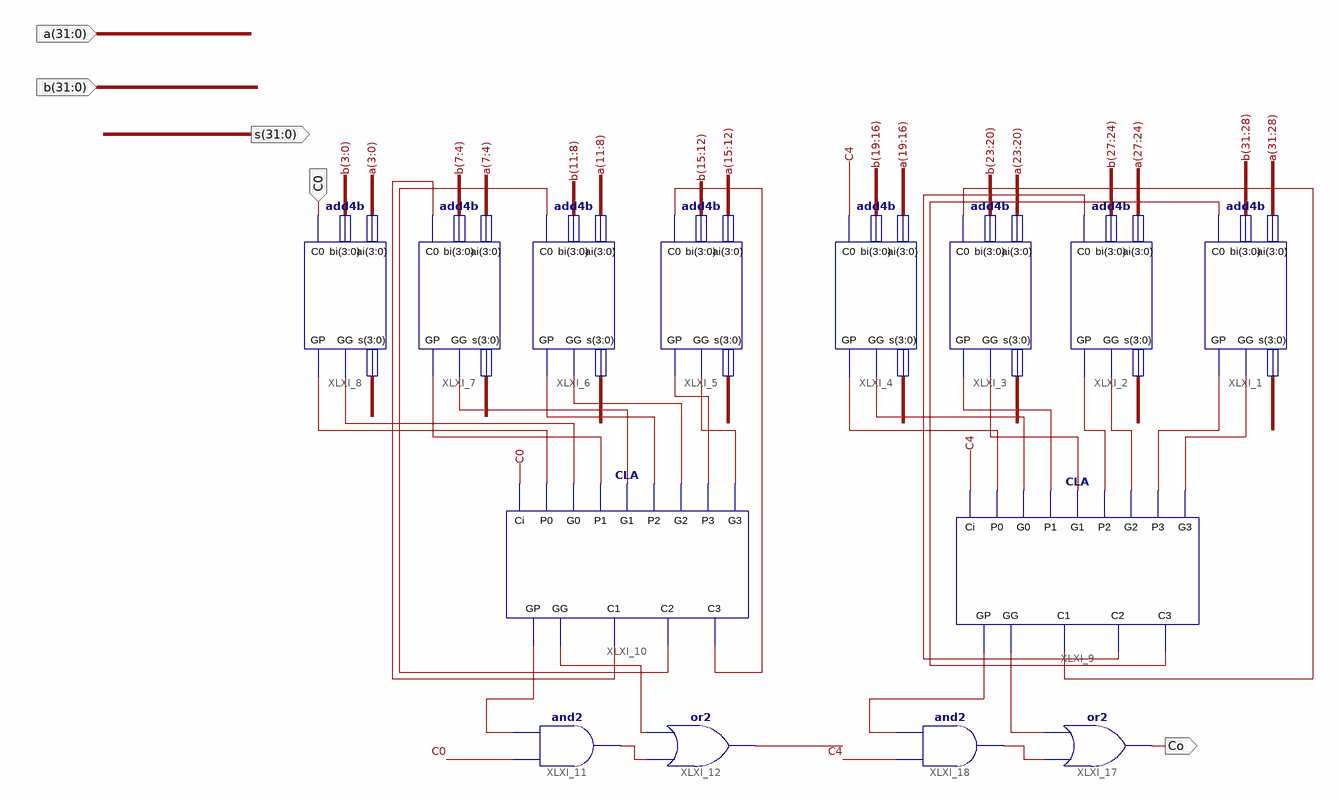
[diagram p0: schematic sheet 1]
// Xilinx ISE schematic adc32.sch (kintex7) as structural Verilog: 14 symbols, 5 ports
module adc32 (
  input  [31:0] a,
  input  [31:0] b,
  input  C0,
  output [31:0] s,
  output Co
);

  wire C4, XLXN_30, XLXN_32, XLXN_33, XLXN_34, XLXN_35, XLXN_36, XLXN_37, XLXN_38, XLXN_39, XLXN_40, XLXN_41,
       XLXN_42, XLXN_43, XLXN_45, XLXN_63, XLXN_64, XLXN_65, XLXN_66, XLXN_67, XLXN_68, XLXN_69, XLXN_70,
       XLXN_71, XLXN_72, XLXN_73, XLXN_75, XLXN_76, XLXN_77;

  add4b XLXI_5 (.ai(a[15:12]), .bi(b[15:12]), .C0(XLXN_41), .s(s[15:12]), .GG(XLXN_37), .GP(XLXN_36));
  add4b XLXI_6 (.ai(a[11:8]), .bi(b[11:8]), .C0(XLXN_40), .s(s[11:8]), .GG(XLXN_35), .GP(XLXN_34));
  add4b XLXI_7 (.ai(a[7:4]), .bi(b[7:4]), .C0(XLXN_39), .s(s[7:4]), .GG(XLXN_33), .GP(XLXN_32));
  add4b XLXI_8 (.ai(a[3:0]), .bi(b[3:0]), .C0(C0), .s(s[3:0]), .GG(XLXN_38), .GP(XLXN_30));
  CLA XLXI_9 (
    .G3(XLXN_70), .P3(XLXN_69), .G2(XLXN_68), .P0(XLXN_63), .Ci(C4), .G0(XLXN_64), .P2(XLXN_67),
    .G1(XLXN_66), .P1(XLXN_65), .C3(XLXN_73), .C2(XLXN_72), .C1(XLXN_71), .GP(XLXN_75), .GG(XLXN_76));
  CLA XLXI_10 (
    .G3(XLXN_37), .P3(XLXN_36), .G2(XLXN_35), .P0(XLXN_30), .Ci(C0), .G0(XLXN_38), .P2(XLXN_34),
    .G1(XLXN_33), .P1(XLXN_32), .C3(XLXN_41), .C2(XLXN_40), .C1(XLXN_39), .GP(XLXN_45), .GG(XLXN_43));
  and XLXI_11 (XLXN_42, C0, XLXN_45);
  or XLXI_12 (C4, XLXN_42, XLXN_43);
  add4b XLXI_3 (.ai(a[23:20]), .bi(b[23:20]), .C0(XLXN_71), .s(s[23:20]), .GG(XLXN_66), .GP(XLXN_65));
  add4b XLXI_2 (.ai(a[27:24]), .bi(b[27:24]), .C0(XLXN_72), .s(s[27:24]), .GG(XLXN_68), .GP(XLXN_67));
  add4b XLXI_4 (.ai(a[19:16]), .bi(b[19:16]), .C0(C4), .s(s[19:16]), .GG(XLXN_64), .GP(XLXN_63));
  add4b XLXI_1 (.ai(a[31:28]), .bi(b[31:28]), .C0(XLXN_73), .s(s[31:28]), .GG(XLXN_70), .GP(XLXN_69));
  or XLXI_17 (Co, XLXN_77, XLXN_76);
  and XLXI_18 (XLXN_77, C4, XLXN_75);
endmodule
